# EAGLE design ROwen_thermocouple (EAGLE 7.2.0)
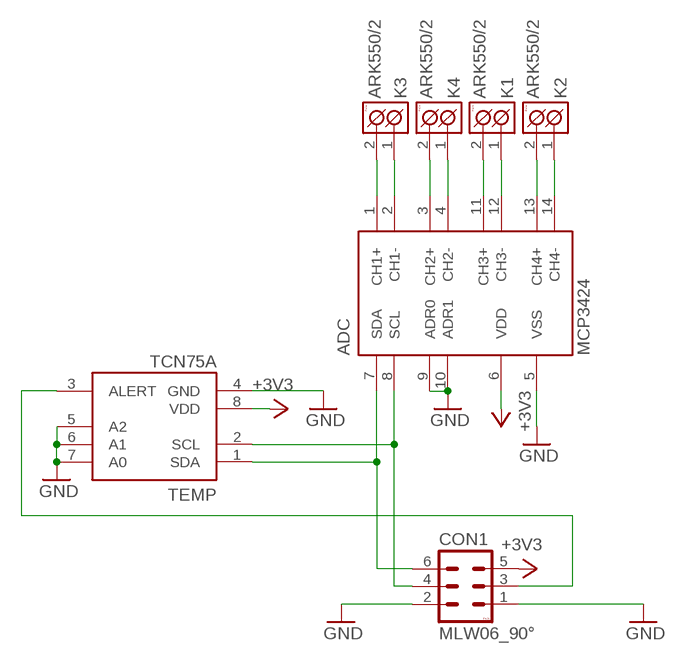
[diagram p0: schematic, sheet 1]

## Parts
ADC  MCP3424  MCP3424TSSOP14  [TSSOP14]
CON1  MLW06_90°  [MLW06A]
K1  ARK550/2  [ARK550/2]
K2  ARK550/2  [ARK550/2]
K3  ARK550/2  [ARK550/2]
K4  ARK550/2  [ARK550/2]
TEMP  TCN75A  [SO8]

## Nets
+3V3: ADC.6(VDD) CON1.5 TEMP.8(VDD)
GND: ADC.5(VSS) ADC.9(ADR0) ADC.10(ADR1) CON1.1 CON1.2 TEMP.4(GND) TEMP.5(A2) TEMP.6(A1) TEMP.7(A0)
N$1: ADC.12(CH3-) K1.1(K1)
N$2: ADC.11(CH3+) K1.2(K2)
N$3: ADC.14(CH4-) K2.1(K1)
N$4: ADC.13(CH4+) K2.2(K2)
N$5: ADC.2(CH1-) K3.1(K1)
N$6: ADC.1(CH1+) K3.2(K2)
N$7: ADC.4(CH2-) K4.1(K1)
N$8: ADC.3(CH2+) K4.2(K2)
N$9: CON1.3 TEMP.3(ALERT)
N$10: ADC.8(SCL) CON1.4 TEMP.2(SCL)
N$11: ADC.7(SDA) CON1.6 TEMP.1(SDA)

## Library data of the parts
ADC = kumen:MCP3424
CON1 = !kumen:MLW06: Konektory MLW - vidlice - 6x
K1-K4 = #PaJa_konektory:ARK550/2: Svorkovnice - roztec 3,5mm - dvojita
TEMP = kumen:TCN75A

## Board
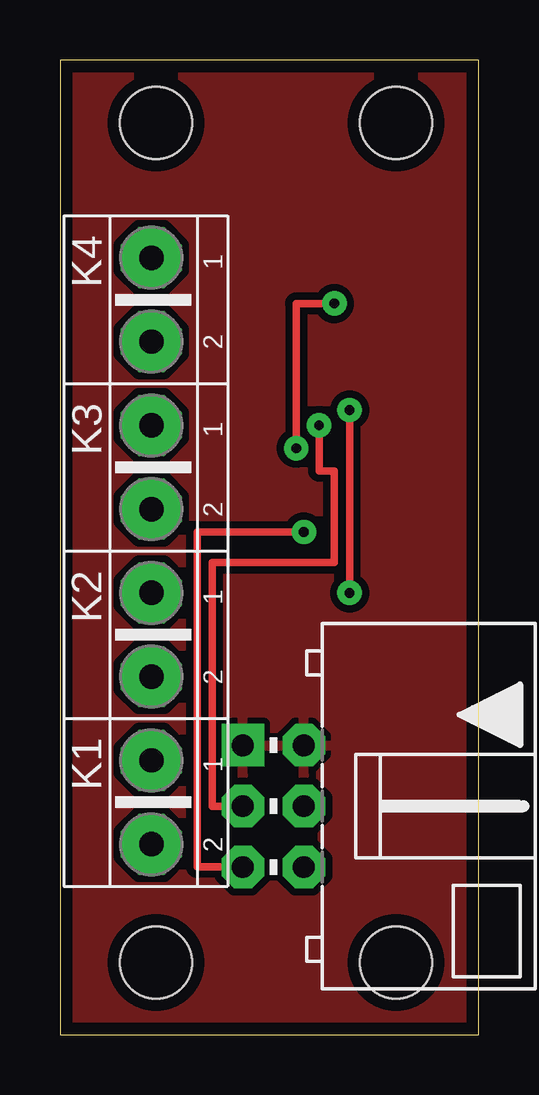
[diagram p1: board, top side]
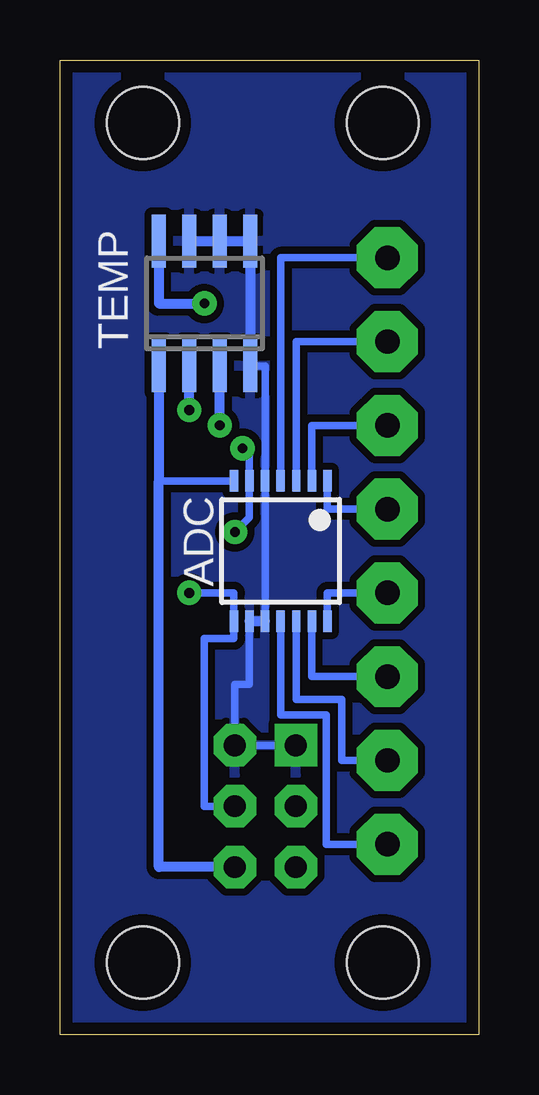
[diagram p2: board, bottom side, seen from below]

Size 17.45 x 40.63 mm. Coordinates in mm from the lower left corner, seen from the top.
Outline: 0,0 17.45,0 17.45,40.63 0,40.63 0,0
Copper layers (1*16): Top 0.035mm / dielectric 1.5mm / Bottom 0.035mm
Design rules "EagleRules *": minimum track width 7mil, minimum drill 12mil, track to track 7mil, track to pad 7mil, pad to pad 7mil, via to via 7mil, smd to smd 0mil, copper to edge 20mil, drill to drill 10mil, minimum pad ring 10mil, minimum via ring 12mil, stop-mask expansion 2mil, vias tented up to drill 25mil, thermal gap 10mil
Holes 3 mm at 4,38 14,38 4,3 14,3

### Footprints (pad centres in the part's own frame; a part is rotated, then mirrored left to right if it is on the bottom)
TSSOP14 = smd 0.35 x 0.9: 1 -1.95,-2.925; 2 -1.3,-2.925; 3 -0.65,-2.925; 4 0,-2.925; 5 0.65,-2.925; 6 1.3,-2.925; 7 1.95,-2.925; 8 1.95,2.925; 9 1.3,2.925; 10 0.65,2.925; 11 0,2.925; 12 -0.65,2.925; 13 -1.3,2.925; 14 -1.95,2.925
MLW06A = drill 0.914 pad 1.778 square: 1 -2.54,-1.27 | drill 0.914 pad 1.778 octagon: 2 -2.54,1.27; 3 0,-1.27; 4 0,1.27; 5 2.54,-1.27; 6 2.54,1.27
ARK550/2 = drill 1.016 pad 2.54 octagon: 1 0,0; 2 3.493,0
SO8 = smd 0.6 x 2.2: 1 -1.905,-2.6; 2 -0.635,-2.6; 3 0.635,-2.6; 4 1.905,-2.6; 5 1.905,2.6; 6 0.635,2.6; 7 -0.635,2.6; 8 -1.905,2.6

### Placement (x,y rotation side)
ADC  8.26,20.16 180 bottom
CON1  8.89,9.53 270 top
K1  3.81,11.43 270 top
K2  3.81,18.41 270 top
K3  3.81,25.4 270 top
K4  3.81,32.38 270 top
TEMP  11.43,30.48 0 bottom

### Tracks (layer width: path | path; a pad name or v marks a point on that pad's centre or on a via)
+3V3  (via drill 0.41)
  Top 0.305: CON1.5 5.71,6.99 5.71,20.95 v10.16,20.95 | v11.43,30.48 9.84,30.48 v9.84,24.45
  Bottom 0.305: v10.16,20.95 9.55,21.56 ADC.6 9.55,24.16 v9.84,24.45
  Bottom 0.406: TEMP.8 13.34,30.48 v11.43,30.48
GND
  Bottom 0.305: TEMP.4 8.9,27.88 ADC.5 ADC.10 | CON1.1 CON1.2 | 10.19,12.06 CON1.2 | CON1.2 10.16,14.61 9.55,14.61 ADC.9
  Bottom 0.406: TEMP.7 TEMP.6 TEMP.5 TEMP.4 | ADC.9 ADC.10
  pour Bottom (isolate 0.305): 0,40.64 0,0 17.46,0 17.46,40.8 0,40.8
  pour Top (isolate 0.305): 0,40.64 0,0 17.46,0 17.46,40.8 0,40.8
N$1
  Bottom 0.305: K1.1 5.71,11.43 5.71,13.97 7.61,13.97 ADC.12
N$2
  Bottom 0.305: K1.2 6.35,7.94 6.35,13.34 8.26,13.34 ADC.11
N$3
  Bottom 0.305: K2.1 6.3,18.41 ADC.14
N$4
  Bottom 0.305: K2.2 6.96,14.92 ADC.13
N$5
  Bottom 0.305: K3.1 6.96,25.4 ADC.2
N$6
  Bottom 0.305: K3.2 6.3,21.91 ADC.1
N$7
  Bottom 0.305: K4.1 8.26,32.38 ADC.4
N$8
  Bottom 0.305: K4.2 7.61,28.89 ADC.3
N$9  (via drill 0.41)
  Top 0.305: CON1.3 6.35,9.53 6.35,19.68 11.43,19.68 11.43,23.5 10.79,23.5 v10.79,25.4
  Bottom 0.406: v10.79,25.4 TEMP.3
N$10  (via drill 0.41)
  Top 0.305: v12.06,18.41 v12.06,26.04
  Bottom 0.305: CON1.4 11.43,9.53 11.43,16.51 10.21,16.51 ADC.8 10.21,18.41 v12.06,18.41
  Bottom 0.406: v12.06,26.04 TEMP.2
N$11
  Bottom 0.305: 13.34,23.09 ADC.7
  Bottom 0.406: CON1.6 13.34,6.99 13.34,23.09 TEMP.1